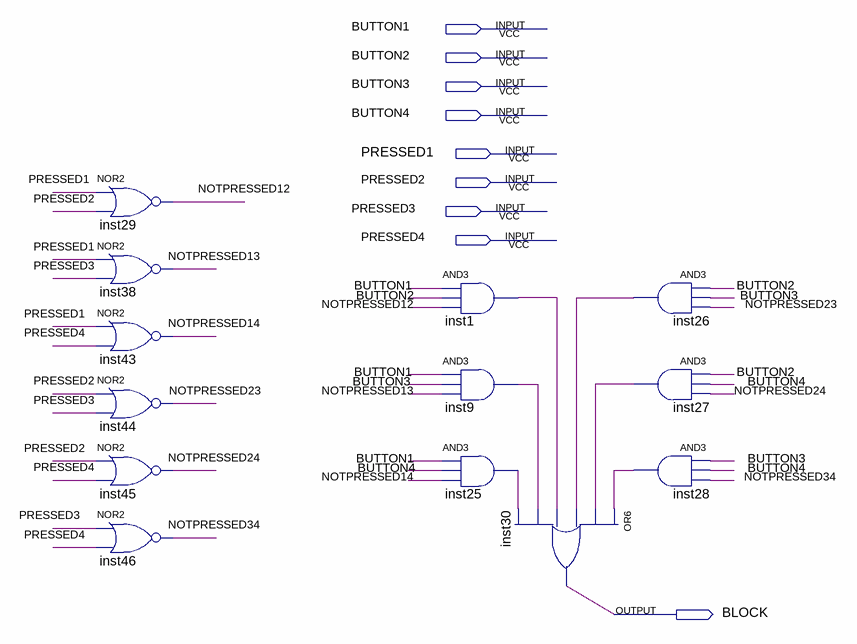
[diagram p0: schematic sheet]
// Quartus schematic block.bdf as structural Verilog: 13 symbols, 9 pins
module block (
  input  BUTTON1,
  input  BUTTON2,
  input  BUTTON3,
  input  BUTTON4,
  input  PRESSED1,
  input  PRESSED2,
  input  PRESSED3,
  input  PRESSED4,
  output BLOCK
);

  wire inst1_out, inst9_out, inst25_out, inst26_out, inst27_out, inst28_out, NOTPRESSED12, NOTPRESSED13,
       NOTPRESSED14, NOTPRESSED23, NOTPRESSED24, NOTPRESSED34;

  nor inst29 (NOTPRESSED12, PRESSED1, PRESSED2);
  nor inst38 (NOTPRESSED13, PRESSED1, PRESSED3);
  nor inst43 (NOTPRESSED14, PRESSED1, PRESSED4);
  nor inst44 (NOTPRESSED23, PRESSED2, PRESSED3);
  nor inst45 (NOTPRESSED24, PRESSED2, PRESSED4);
  nor inst46 (NOTPRESSED34, PRESSED3, PRESSED4);
  and inst1 (inst1_out, BUTTON1, BUTTON2, NOTPRESSED12);
  and inst9 (inst9_out, BUTTON1, BUTTON3, NOTPRESSED13);
  and inst25 (inst25_out, BUTTON1, BUTTON4, NOTPRESSED14);
  or inst30 (BLOCK, inst28_out, inst27_out, inst26_out, inst1_out, inst9_out, inst25_out);
  and inst26 (inst26_out, BUTTON2, BUTTON3, NOTPRESSED23);
  and inst27 (inst27_out, BUTTON2, BUTTON4, NOTPRESSED24);
  and inst28 (inst28_out, BUTTON3, BUTTON4, NOTPRESSED34);
endmodule
